# Altium schematic sheet Power_Supply.SchDoc: Ixora
size A3; Organization: Toradex AG; Address1: Altsagenstrasse 5; Address2: Horw; Address3: 6048; Address4: Switzerland; DocumentNumber: 3; Revision: V1.1; SheetNumber: 3; SheetTotal: 19; PageSetup: Record=PageOptions|CenterHorizontal=True|CenterVertical=True|PrintScale=0.73|XCorrection=1.00|YCorrection=1.00|PrintKind=0|BorderSize=5000000|LeftOffset=0|BottomOffset=0|Orientation=2|PaperLength=1000|PaperWidth=1000|Scale=100|PaperSource=7|PrintQuality=-4|MediaType=1|DitherType=10|PaperKind=A4|PrintScaleMode=1
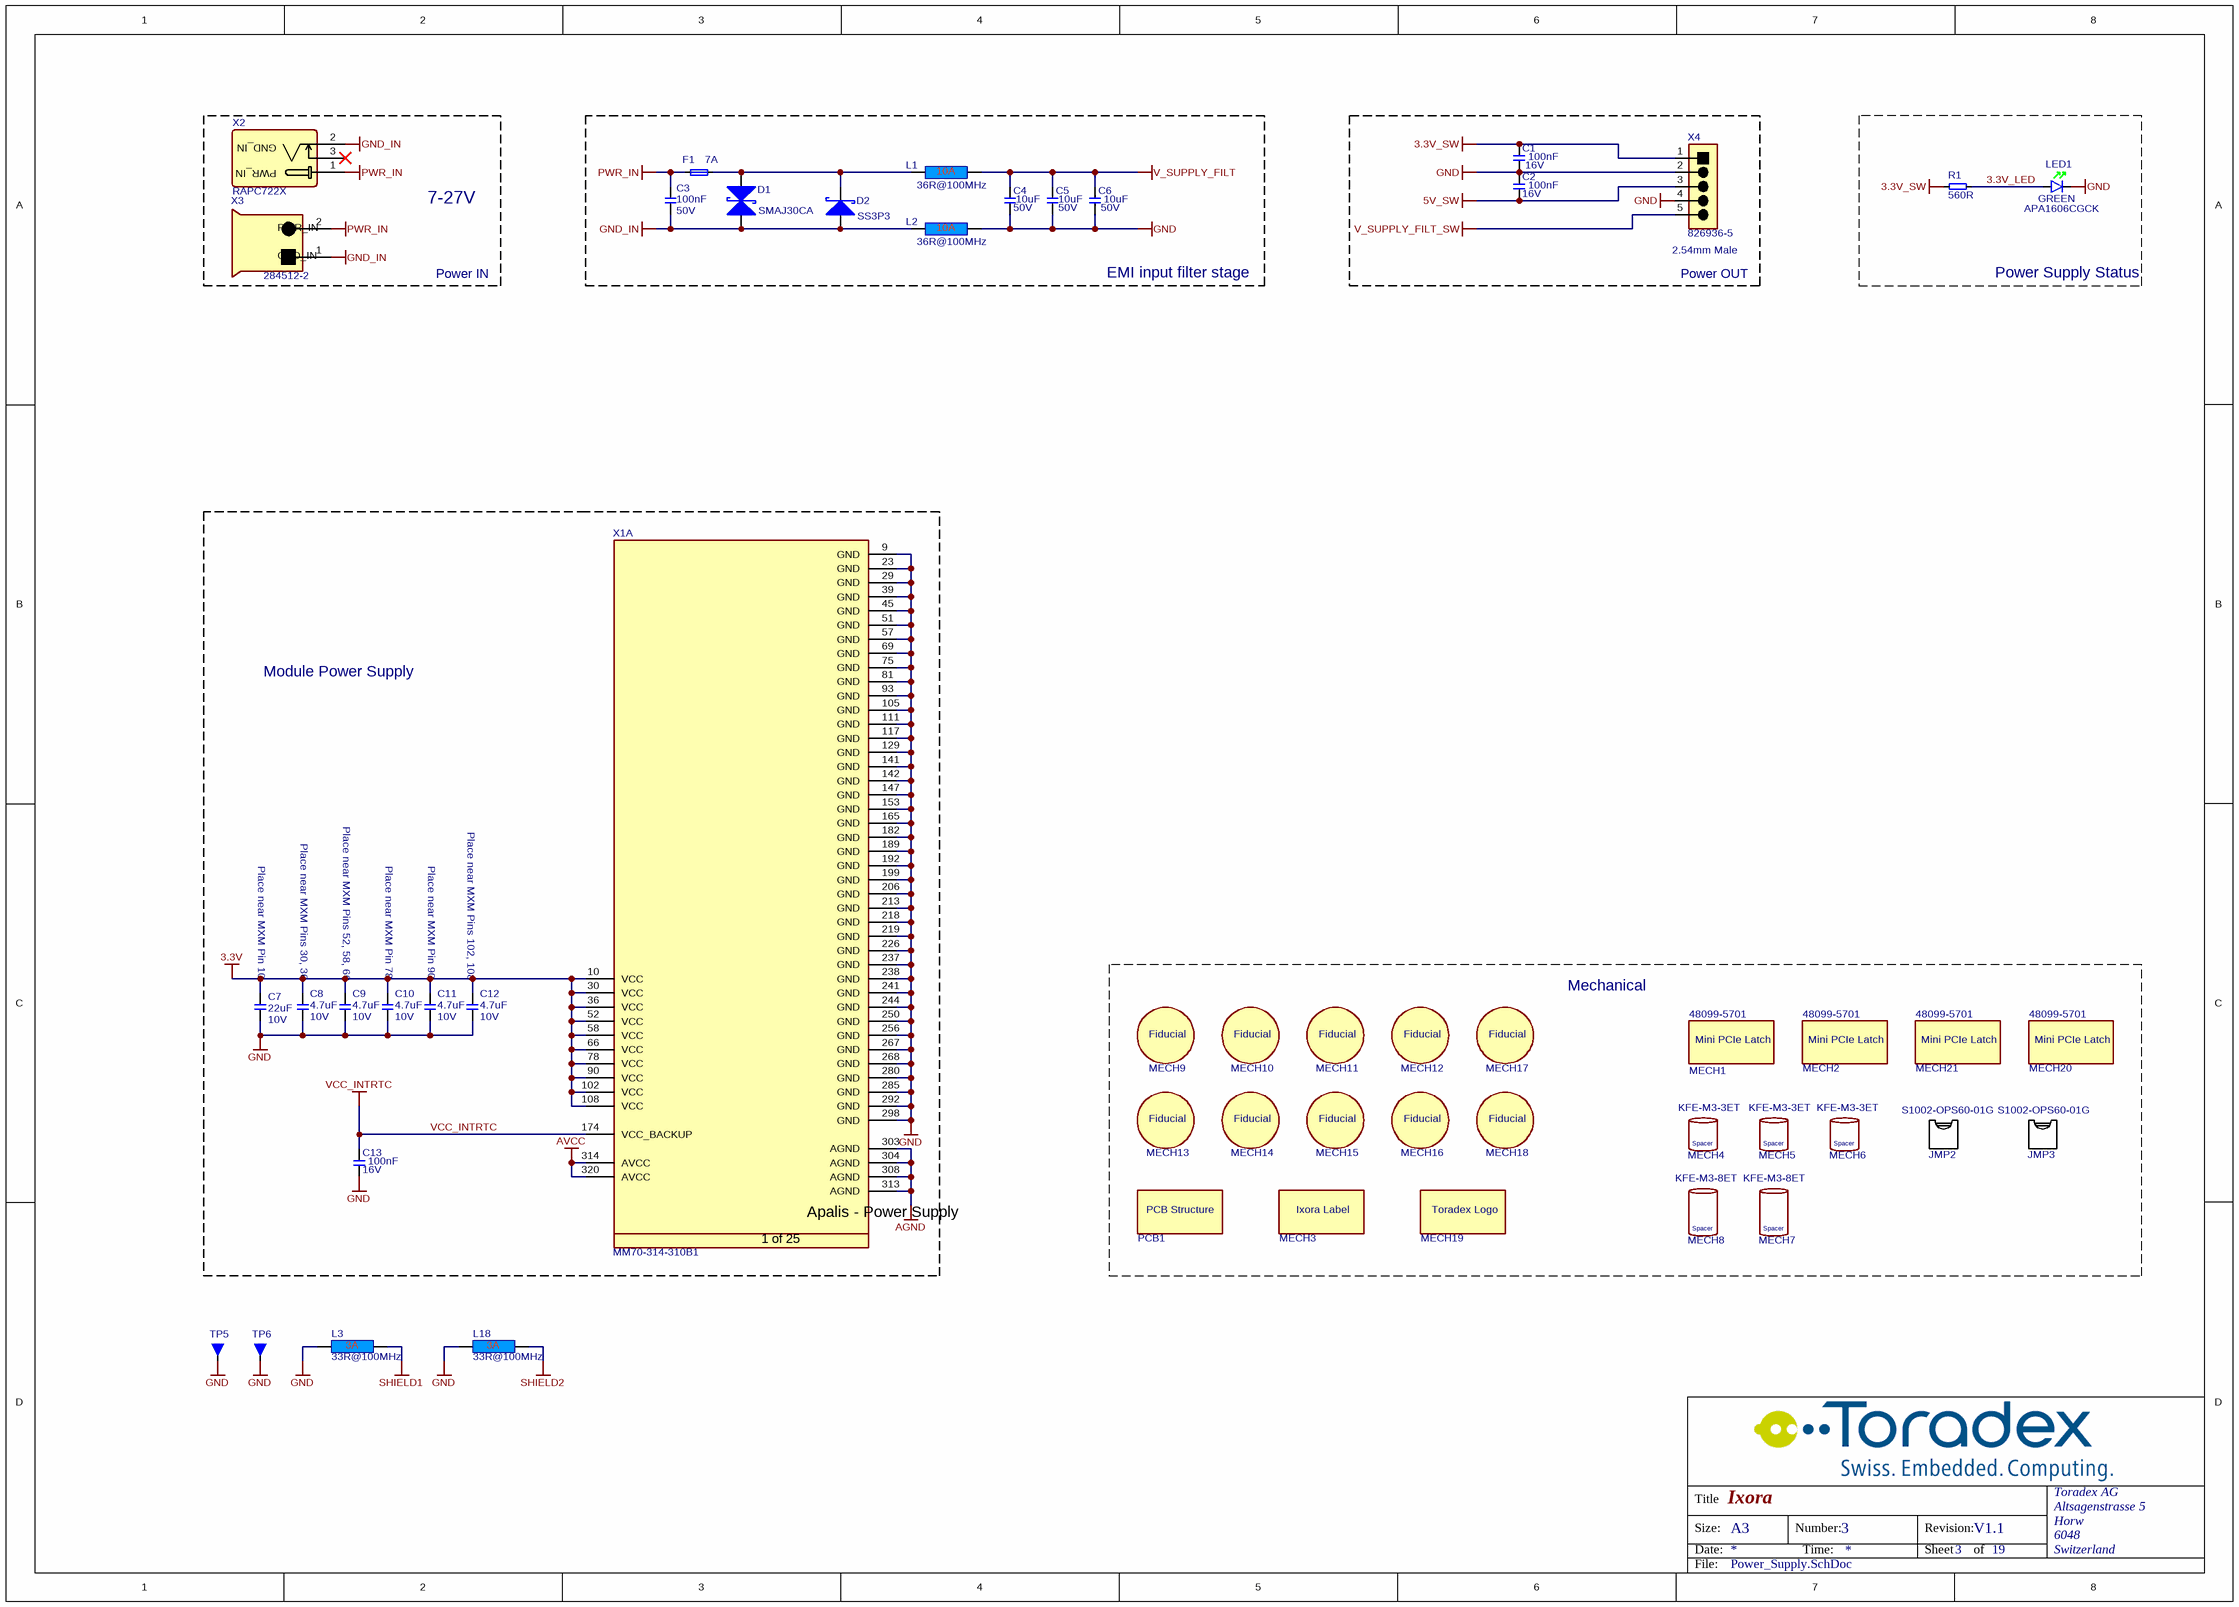
[diagram p0: Power_Supply.SchDoc]

## Parts
C1  Rating: 16V  [CAPC1005X60N]  (hidden comment: 100nF)
C2  Rating: 16V  [CAPC1005X60N]  (hidden comment: 100nF)
C3  Rating: 50V  [T_CAPC0603X33N]  (hidden comment: 100nF)
C4  Rating: 50V  [CAPC3225X160N]  (hidden comment: 10uF)
C5  Rating: 50V  [CAPC3225X160N]  (hidden comment: 10uF)
C6  Rating: 50V  [CAPC3225X160N]  (hidden comment: 10uF)
C7  Rating: 10V  [T_CAPC0805X125N]  (hidden comment: 22uF)
C8  Rating: 10V  [T_CAPC0603X33N]  (hidden comment: 4.7uF)
C9  Rating: 10V  [T_CAPC0603X33N]  (hidden comment: 4.7uF)
C10  Rating: 10V  [T_CAPC0603X33N]  (hidden comment: 4.7uF)
C11  Rating: 10V  [T_CAPC0603X33N]  (hidden comment: 4.7uF)
C12  Rating: 10V  [T_CAPC0603X33N]  (hidden comment: 4.7uF)
C13  Rating: 16V  [CAPC1005X60N]  (hidden comment: 100nF)
D1  Manufacturer Part No.: SMAJ30CA  [T_LITTLEFUSE_SMAJ30CA]  (hidden comment: D-Littelfuse-SMAJ30CA-Schottky)
D2  SS3P3  [T_VISHAY_SS3P3]
F1  7A  [T_Littelfuse_0458]
JMP2  Manufacturer Part No.: S1002-OPS60-01G  (hidden comment: Shunt Jumper)  (mechanical)
JMP3  Manufacturer Part No.: S1002-OPS60-01G  (hidden comment: Shunt Jumper)  (mechanical)
L1  36R@100MHz  [T_Laird_35F0121-0SR-10]
L2  36R@100MHz  [T_Laird_35F0121-0SR-10]
L3  33R@100MHz  [INDC1608X95N]
L18  33R@100MHz  [INDC1608X95N]
LED1  Color: GREEN  [T_Kingbright_APA1606CGCK]  (hidden comment: APA1606CGCK)
MECH1  Manufacturer Part No.: 48099-5701  [T_Molex_48099-5701]  (hidden comment: MECH-Mini-PCIe Latch)
MECH2  Manufacturer Part No.: 48099-5701  [T_Molex_48099-5701]  (hidden comment: MECH-Mini-PCIe Latch)
MECH3  IxoraV1.1.001-Label  (value not drawn)  (no BOM)
MECH4  KFE-M3-3ET  (mechanical)
MECH5  KFE-M3-3ET  (mechanical)
MECH6  KFE-M3-3ET  (mechanical)
MECH7  KFE-M3-8ET  (mechanical)
MECH8  KFE-M3-8ET  (mechanical)
MECH9  MECH-Fiducial  [T_Fiducial]  (value not drawn)  (no BOM)
MECH10  MECH-Fiducial  [T_Fiducial]  (value not drawn)  (no BOM)
MECH11  MECH-Fiducial  [T_Fiducial]  (value not drawn)  (no BOM)
MECH12  MECH-Fiducial  [T_Fiducial]  (value not drawn)  (no BOM)
MECH13  MECH-Fiducial  [T_Fiducial]  (value not drawn)  (no BOM)
MECH14  MECH-Fiducial  [T_Fiducial]  (value not drawn)  (no BOM)
MECH15  MECH-Fiducial  [T_Fiducial]  (value not drawn)  (no BOM)
MECH16  MECH-Fiducial  [T_Fiducial]  (value not drawn)  (no BOM)
MECH17  MECH-Fiducial  [T_Fiducial]  (value not drawn)  (no BOM)
MECH18  MECH-Fiducial  [T_Fiducial]  (value not drawn)  (no BOM)
MECH19  MECH-Toradex_Logo  [T_TORADEX_LOGO]  (value not drawn)  (no BOM)
MECH20  Manufacturer Part No.: 48099-5701  (hidden comment: MECH-Mini-PCIe Latch)
MECH21  Manufacturer Part No.: 48099-5701  (hidden comment: MECH-Mini-PCIe Latch)
PCB1  PCB-IxoraV1.1.001  (value not drawn)
R1  560R  [RESC1005X40N]
TP5  5011  [T_TP-THT - EYE]  (value not drawn)
TP6  5011  [T_TP-THT - EYE]  (value not drawn)
X1  Manufacturer Part No.: MM70-314-310B1  [T_JAE_MM70-314-310B1]  (hidden comment: CON-JAE-MM70-314-310B1-314-0.5mm)  (part A of 25)
X2  RAPC722X  [T_RAPC722X]
X3  284512-2  [T_TYCO_284512-2]
X4  826936-5  [T_TYCO_826936-5]

## Blocks framed on the sheet
7-27V: X2 X3
EMI input filter stage: C3-C6 D1 D2 F1 L1 L2
Power OUT: C1 C2 X4
Power Supply Status: LED1 R1
Module Power Supply: C7-C13 X1
Mechanical: JMP2 JMP3 MECH1-MECH21 PCB1

## Nets
3.3V: C7.1 C8.1 C9.1 C10.1 C11.1 C12.1 X1.10(VCC) X1.30(VCC) X1.36(VCC) X1.52(VCC) X1.58(VCC) X1.66(VCC) X1.78(VCC) X1.90(VCC) X1.102(VCC) X1.108(VCC)
3.3V_SW: C1.2 R1.1 X4.1
5V_SW: C2.1 X4.3
AGND: X1.303(AGND) X1.304(AGND) X1.308(AGND) X1.313(AGND)
AVCC: X1.314(AVCC) X1.320(AVCC)
GND: C1.1 C2.2 C4.1 C5.1 C6.1 C7.2 C8.2 C9.2 C10.2 C11.2 C12.2 C13.1 L2.2 L3.1 L18.1 LED1.1(K) TP5.1 TP6.1 X1.9(GND) X1.23(GND) X1.29(GND) X1.39(GND) X1.45(GND) X1.51(GND) X1.57(GND) X1.69(GND) X1.75(GND) X1.81(GND) X1.93(GND) X1.105(GND) X1.111(GND) X1.117(GND) X1.129(GND) X1.141(GND) X1.142(GND) X1.147(GND) X1.153(GND) X1.165(GND) X1.182(GND) X1.189(GND) X1.192(GND) X1.199(GND) X1.206(GND) X1.213(GND) X1.218(GND) X1.219(GND) X1.226(GND) X1.237(GND) X1.238(GND) X1.241(GND) X1.244(GND) X1.250(GND) X1.256(GND) X1.267(GND) X1.268(GND) X1.280(GND) X1.285(GND) X1.292(GND) X1.298(GND) X4.2 X4.4
GND_IN: C3.1 D1.2(Anode) D2.2 L2.1 X2.2(PWR_IN) X3.1(GND_IN)
PWR_IN: C3.2 F1.1 X2.1(GND_IN) X3.2(PWR_IN)
SHIELD1: L3.2
SHIELD2: L18.2
V_SUPPLY_FILT: C4.2 C5.2 C6.2 L1.2
V_SUPPLY_FILT_SW: X4.5
VCC_INTRTC: C13.2 X1.174(VCC_BACKUP)
3.3V_LED: LED1.2(A) R1.2
NetD1_1: D1.1(Cathode) D2.1 F1.2 L1.1

Not connected (* = marked no-connect by the designer): X2 3(PWR_IN)*

## Notes on the sheet
- (near X4) 2.54mm Male
- Power IN
- (near C8) Place near MXM Pins 30, 36
- (near C9) Place near MXM Pins 52, 58, 66
- Place near MXM Pins 102, 108
- Place near MXM Pin 10
- Place near MXM Pin 78
- Place near MXM Pin 90
- Title
- Size:
- Date:
- A3
- Number:
- Time:
- Revision:
- Sheet
- of
- File:
- (in symbol CON-JAE-MM70-314-310B1-314-0.5mm, part A) Apalis - Power Supply; 1 of 25
- (in symbol MECH-HiTech-KFE-M3-3ET) Spacer
- (in symbol MECH-HiTech-KFE-M3-8ET) Spacer
- (in symbol MECH-IxoraV1.1.001-Label) Ixora Label
- (in symbol MECH-Molex-48099-5701) Mini PCIe Latch
- (in symbol MECH-Toradex_Logo) Toradex Logo

## Library data of the parts
C1 C2 C13 = C-X7R-100nF-16V-10%-0402: Capacitor Ceramic X7R 100nF 16V 10% 0402; Tolerance: 10%; Type: X7R; Value: 100nF
C3 = C-X7R-100nF-50V-20%-0603: Capacitor Ceramic X7R 100nF 50V 20% 0603; Tolerance: 20%; Type: X7R; Value: 100nF
C4-C6 = C-X5R-10uF-50V-20%-1210: Capacitor Ceramic X5R 10uF 50V 20% 1210; Tolerance: 20%; Type: X5R; Value: 10uF
C7 = C-X5R-22uF-10V-20%-0805: Capacitor Ceramic X5R 22uF 10V 20% 0805; Tolerance: 20%; Type: X5R; Value: 22uF
C8-C12 = C-X5R-4.7uF-10V-10%-0603: Capacitor Ceramic X5R 4.7uF 10V 10% 0603; Tolerance: 10%; Type: X5R; Value: 4.7uF
D1 = D-Littelfuse-SMAJ30CA-Schottky: Bidirectional ESD protection; Manufacturer Name: Littelfuse
D2 = D-Vishay-SS3P3-E3/84A-Schottky: SS3P3-E3/84A Schottky Diode; Manufacturer Name: Vishay; Manufacturer Part No.: SS3P3-E3/84A
F1 = F-Littelfuse-0458007: Fuse 7A Fast; Manufacturer Part No.: 0458007; Manufacturer Name: Littelfuse; Value: 7A
JMP2 JMP3 = MECH-Shunt-Jumper-Black-2.54mm: Manufacturer Name: JVE
L1 L2 = L-Laird-35F0121-0SR-10-10A-25%: Power Supply FB 10A; Tolerance: 25%; Rating: 10A; Value: 36R@100MHz
L3 L18 = L-33R@100MHz-3A-25%-0603: 33R@100MHz 3A EMI FILTER; Tolerance: 25%; Rating: 3A; Value: 33R@100MHz
LED1 = LED-Kingbright-APA1606CGCK: LED green Kingbright APA1606CGCK; Manufacturer Name: Kingbright; Manufacturer Part No.: APA1606CGCK
MECH1 MECH2 MECH20 MECH21 = MECH-Molex-48099-5701: Mini-PCIe Latch; Manufacturer Name: Molex
MECH3 = MECH-IxoraV1.1.001-Label
MECH4-MECH6 = MECH-HiTech-KFE-M3-3ET: Spacer 3mm M3; Manufacturer Name: Hi-Tech Fasteners Inc; Manufacturer Part No.: KFE-M3-3ET
MECH7 MECH8 = MECH-HiTech-KFE-M3-8ET: Spacer 8mm M3; Manufacturer Name: Hi-Tech Fasteners Inc; Manufacturer Part No.: KFE-M3-8ET
MECH9-MECH18 = MECH-Fiducial: Fiducial
MECH19 = MECH-Toradex_Logo: Toradex_Logo
PCB1 = PCB-IxoraV1.1.001: PCB Structure
R1 = R-560R-63mW-5%-0402: Resistor 560 ohm 63mW 5% 0402; Rating: 63mW; Tolerance: 5%; Value: 560R
TP5 TP6 = TP-Keystone-5011: Testpin Eye TH; Manufacturere Name: Keystone; Manufacturere Part No.: 5011
X1 = CON-JAE-MM70-314-310B1-314-0.5mm: MXM3 Connector; Manufacturer Name: JAE; No. of ways: 314
X2 = CON-SWC-RAPC722X: Power Jack; Manufacturer Name: SWC; Manufacturer Part No.: RAPC722X
X3 = CON-Tyco-284512-2-1x2-3.5mm: Power Connector; Manufacturer Name: Tyco; No. of ways: 1x2; Pitch: 3.5mm; Manufacturer Part No.: 284512-2
X4 = CON-Tyco-826936-5-1X5-2.54mm: Header, 5-Pin; Manufacturer Name: Tyco; No. of ways: 1X5; Pitch: 2.54mm; Manufacturer Part No.: 826936-5